# Altium schematic sheet 02-ESP32.SchDoc: *ESP32LX6
size A4; SheetNumber: 3; SheetTotal: 7
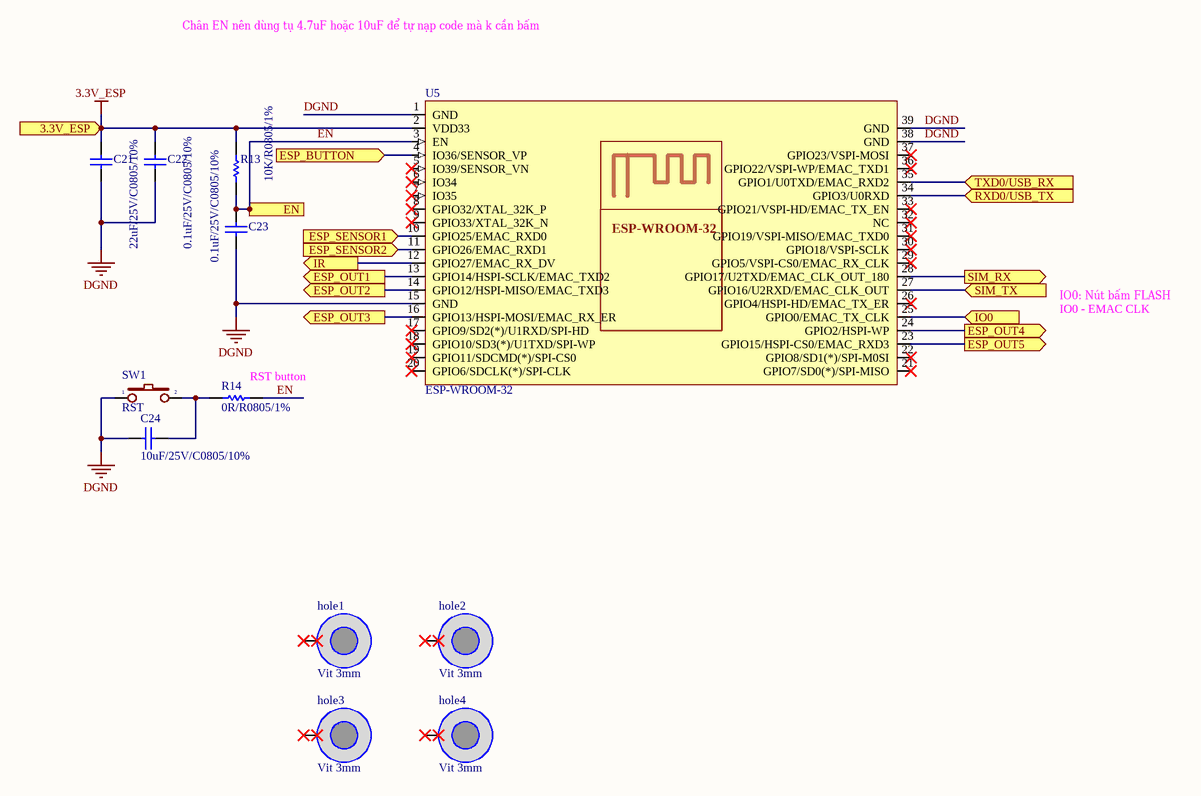
[diagram p0: 02-ESP32.SchDoc]

## Parts
C21  22uF/25V/C0805/10%  [CAP_CERA_C2012(CC0805INCH)]
C22  0.1uF/25V/C0805/10%  [CAP_CERA_C2012(CC0805INCH)]
C23  0.1uF/25V/C0805/10%  [CAP_CERA_C2012(CC0805INCH)]
C24  10uF/25V/C0805/10%  [CAP_CERA_C2012(CC0805INCH)]
hole1  Vit 3mm  [Screw 3.0]
hole2  Vit 3mm  [Screw 3.0]
hole3  Vit 3mm  [Screw 3.0]
hole4  Vit 3mm  [Screw 3.0]
R13  10K/R0805/1%  [Res 0805 SMD]
R14  0R/R0805/1%  [Res 0805 SMD]
SW1  RST  [Button 3x4mm]
U5  ESP-WROOM-32  [ESP32 WROOM]

## Ports
3.3V_ESP (in), EN (in), ESP_BUTTON (in), ESP_OUT1 (out), ESP_OUT2 (out), ESP_OUT3 (out), ESP_OUT4 (out), ESP_OUT5 (out), ESP_SENSOR1 (in), ESP_SENSOR2 (in), IO0 (in), IR (out), RXD0/USB_TX (in), SIM_RX (out), SIM_TX (in), TXD0/USB_RX (in)

## Nets
3.3V_ESP: C21.2 C22.2 R13.1 U5.2(VDD33) ; port 3.3V_ESP
DGND: C21.1 C22.1 C23.1 C24.2 SW1.1 U5.1(GND) U5.15(GND) U5.38(GND) U5.39(GND)
EN: C23.2 R13.2 R14.2 U5.3(EN) ; port EN
ESP_BUTTON: U5.4(IO36/SENSOR_VP) ; port ESP_BUTTON
ESP_OUT1: U5.13(GPIO14/HSPI-SCLK/EMAC_TXD2) ; port ESP_OUT1
ESP_OUT2: U5.14(GPIO12/HSPI-MISO/EMAC_TXD3) ; port ESP_OUT2
ESP_OUT3: U5.16(GPIO13/HSPI-MOSI/EMAC_RX_ER) ; port ESP_OUT3
ESP_OUT4: U5.24(GPIO2/HSPI-WP) ; port ESP_OUT4
ESP_OUT5: U5.23(GPIO15/HSPI-CS0/EMAC_RXD3) ; port ESP_OUT5
ESP_SENSOR1: U5.10(GPIO25/EMAC_RXD0) ; port ESP_SENSOR1
ESP_SENSOR2: U5.11(GPIO26/EMAC_RXD1) ; port ESP_SENSOR2
IO0: U5.25(GPIO0/EMAC_TX_CLK) ; port IO0
IR: U5.12(GPIO27/EMAC_RX_DV) ; port IR
RXD0/USB_TX: U5.34(GPIO3/U0RXD) ; port RXD0/USB_TX
SIM_RX: U5.28(GPIO17/U2TXD/EMAC_CLK_OUT_180) ; port SIM_RX
SIM_TX: U5.27(GPIO16/U2RXD/EMAC_CLK_OUT) ; port SIM_TX
TXD0/USB_RX: U5.35(GPIO1/U0TXD/EMAC_RXD2) ; port TXD0/USB_RX
NetC24_1: C24.1 R14.1 SW1.2

Not connected (* = marked no-connect by the designer): hole1 1(hole)*; hole2 1(hole)*; hole3 1(hole)*; hole4 1(hole)*; U5 5(IO39/SENSOR_VN)* 6(IO34)* 7(IO35)* 8(GPIO32/XTAL_32K_P)* 9(GPIO33/XTAL_32K_N)* 17(GPIO9/SD2(*)/U1RXD/SPI-HD)* 18(GPIO10/SD3(*)/U1TXD/SPI-WP)* 19(GPIO11/SDCMD(*)/SPI-CS0)* 20(GPIO6/SDCLK(*)/SPI-CLK)* 21(GPIO7/SD0(*)/SPI-MISO)* 22(GPIO8/SD1(*)/SPI-M0SI)* 26(GPIO4/HSPI-HD/EMAC_TX_ER)* 29(GPIO5/VSPI-CS0/EMAC_RX_CLK)* 30(GPIO18/VSPI-SCLK)* 31(GPIO19/VSPI-MISO/EMAC_TXD0)* 32(NC)* 33(GPIO21/VSPI-HD/EMAC_TX_EN)* 36(GPIO22/VSPI-WP/EMAC_TXD1)* 37(GPIO23/VSPI-MOSI)*

## Notes on the sheet
- Chân EN nên dùng tụ 4.7uF hoặc 10uF để tự nạp code mà k cần bấm
- IO0: Nút bấm FLASH
- IO0 - EMAC CLK
- (near R14) RST button
- Title
- Size:
- Date:
- A4
- Number:
- Time:
- Revision:
- Sheet
- of
- File:

## Library data of the parts
C21 = 0.1uF/50V/C0603/10%: 22µF ±20% 25V Ceramic Capacitor X5R 0805 (2012 Metric); Manufacturer: Tariff Applied; ComponentLink1URL: http://www.murata.com/~/media/webrenewal/support/library/catalog/products/capacitor/mlcc/c02e.ashx; ComponentLink1Description: http://www.murata.com/~/media/webrenewal/support/library/catalog/products/capacitor/mlcc/c02e.ashx; Digikey: 1276-2908-1-ND
C22-C24 = 0.1uF/50V/C0603/10%: 0.1µF ±10% 25V Ceramic Capacitor X7R 0805 (2012 Metric); ComponentLink1URL: http://www.murata.com/~/media/webrenewal/support/library/catalog/products/capacitor/mlcc/c02e.ashx; ComponentLink1Description: http://www.murata.com/~/media/webrenewal/support/library/catalog/products/capacitor/mlcc/c02e.ashx; Digikey: 478-3755-1-ND
R13 = 200K/R0603/1%: 10 kOhms ±1% 0.125W, 1/8W Chip Resistor 0805 (2012 Metric) Thick Film; Power (Watts): 0.1W, 1/10W; RoHS: RoHS Compliant; Category: Resistors; Part Status: Active; Features: Moisture Resistant; Operating Temperature: -55°C ~ 155°C; Package / Case: 0603 (1608 Metric); Supplier Device Package: 0603; Size / Dimension: 0.063" L x 0.031" W (1.60mm x 0.80mm); Height - Seated (Max): 0.022" (0.55mm); Failure Rate: -; ComponentLink1URL: http://www.yageo.com/documents/recent/PYu-RC_Group_51_RoHS_L_7.pdf; ComponentLink1Description: http://www.yageo.com/documents/recent/PYu-RC_Group_51_RoHS_L_7.pdf; Digikey: A126332CT-ND
R14 = 200K/R0603/1%: 0 Ohms Jumper 0.125W, 1/8W Chip Resistor 0805 (2012 Metric) Automotive AEC-Q200 Thick Film; Part Status: Active; Height - Seated (Max): 0.022" (0.55mm); Failure Rate: -; ComponentLink1URL: http://www.yageo.com/documents/recent/PYu-RC_Group_51_RoHS_L_7.pdf; ComponentLink1Description: http://www.yageo.com/documents/recent/PYu-RC_Group_51_RoHS_L_7.pdf; Digikey: 541-0.0ACT-ND
SW1 = SW2: SWITCH TACTILE SPST-NO 0.05A 12V; Digikey: CKN10384CT-ND
U5 = ESP-WROOM-32: ESP-WROOM-32 (8MB), WIFI MODULE 64 MBITS SPI FLASH; Digikey: 1904-1019-1-ND